# EAGLE design UCLED (EAGLE 9.3.2)
Assembly variants: BASIC
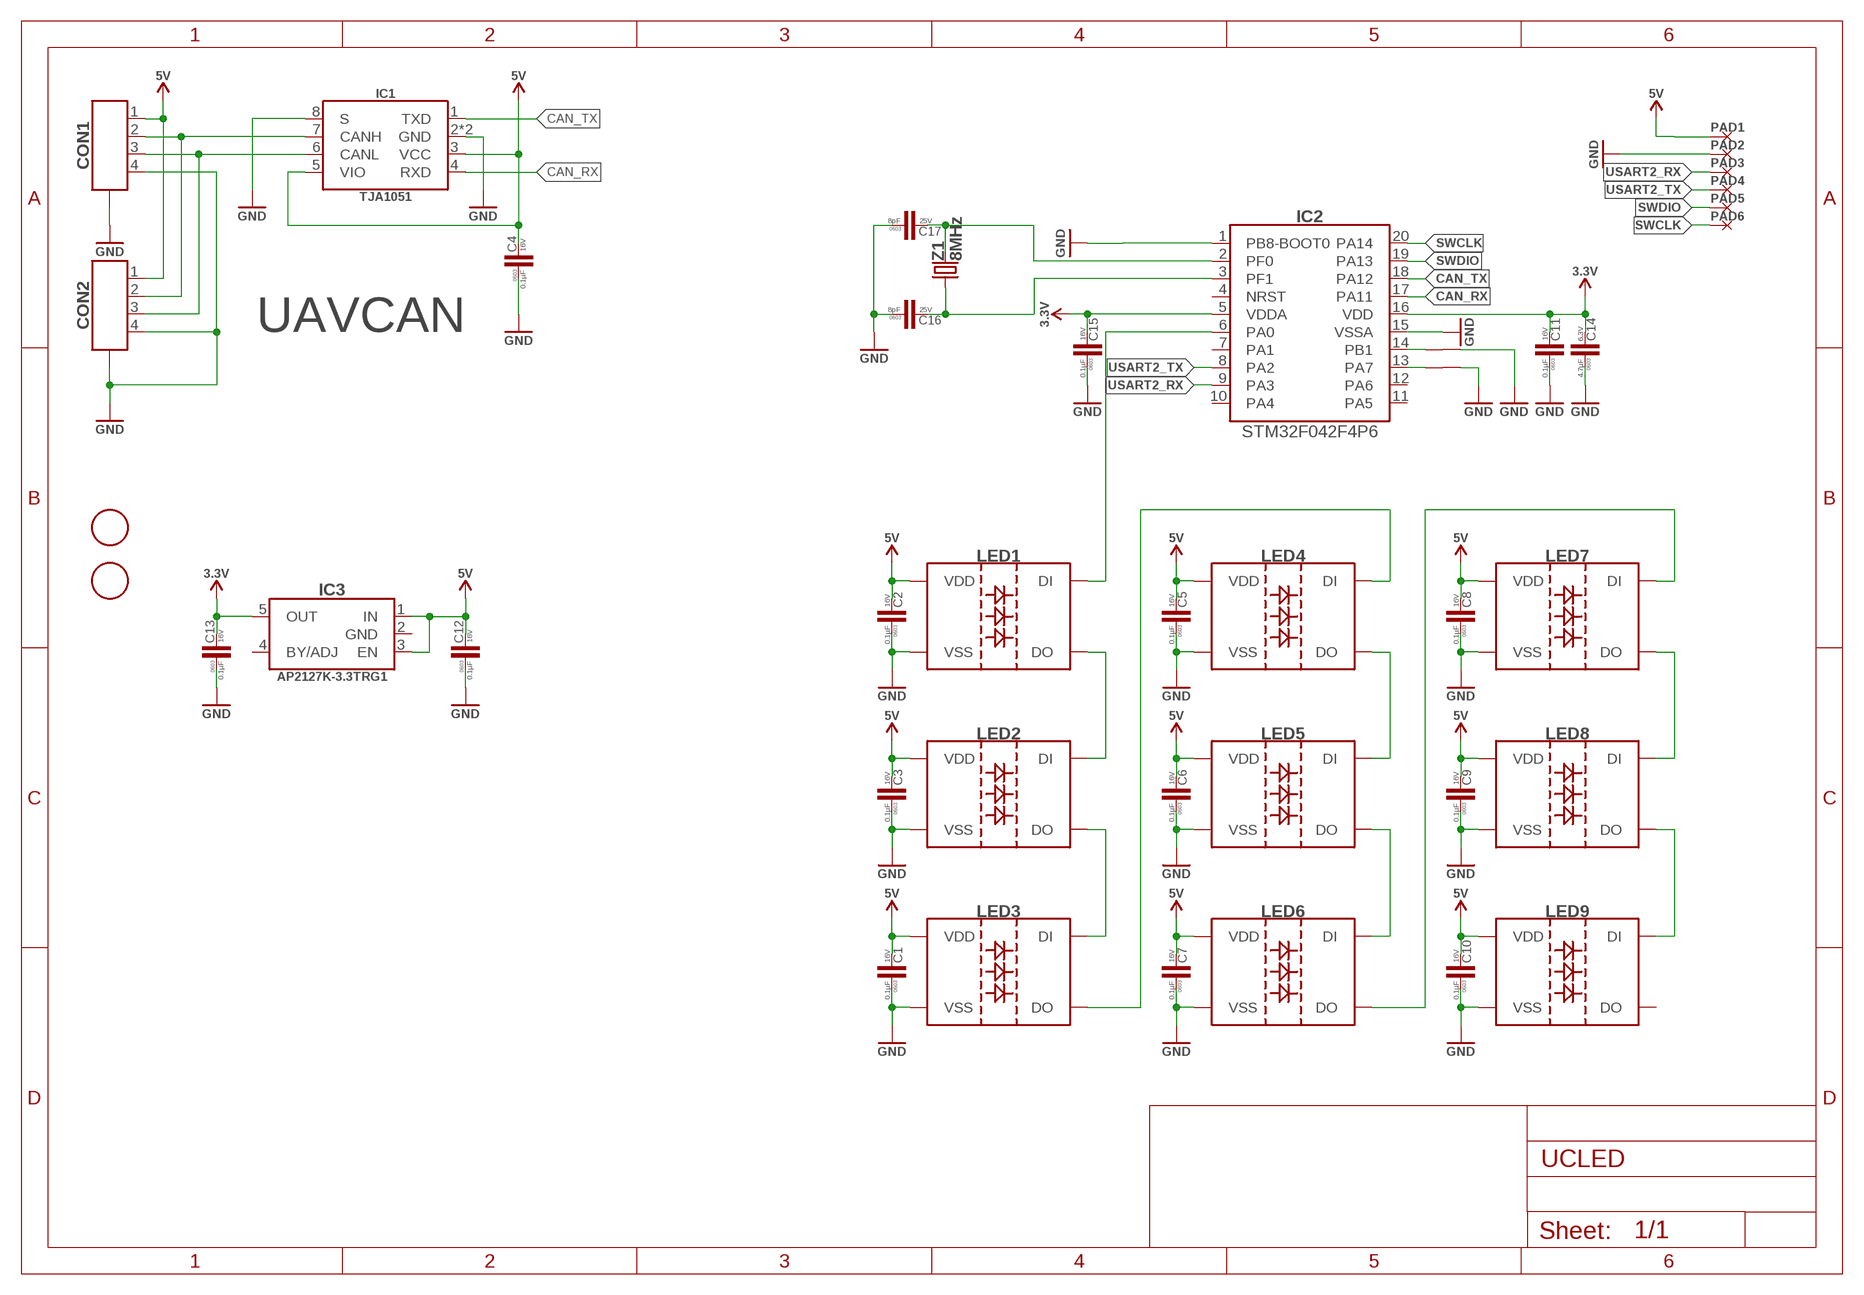
[diagram p0: schematic, sheet 1]

## Parts
C1  0.1µF  0.1µF-16V_10%_X7R-0603  [C0603]
C2  0.1µF  0.1µF-16V_10%_X7R-0603  [C0603]
C3  0.1µF  0.1µF-16V_10%_X7R-0603  [C0603]
C4  0.1µF  0.1µF-16V_10%_X7R-0603  [C0603]
C5  0.1µF  0.1µF-16V_10%_X7R-0603  [C0603]
C6  0.1µF  0.1µF-16V_10%_X7R-0603  [C0603]
C7  0.1µF  0.1µF-16V_10%_X7R-0603  [C0603]
C8  0.1µF  0.1µF-16V_10%_X7R-0603  [C0603]
C9  0.1µF  0.1µF-16V_10%_X7R-0603  [C0603]
C10  0.1µF  0.1µF-16V_10%_X7R-0603  [C0603]
C11  0.1µF  0.1µF-16V_10%_X7R-0603  [C0603]
C12  0.1µF  0.1µF-16V_10%_X7R-0603  [C0603]
C13  0.1µF  0.1µF-16V_10%_X7R-0603  [C0603]
C14  4.7µF  4.7µF-6.3V_10%_X5R-0603  [C0603]
C15  0.1µF  0.1µF-16V_10%_X7R-0603  [C0603]
C16  8pF  8PF-25V_10%_X7R-0603  [C0603]
C17  8pF  8PF-25V_10%_X7R-0603  [C0603]
CON1  CON-4P-TABS-JST_GH-RA  [JST_GH-4P-RA]
CON2  CON-4P-TABS-JST_GH-RA  [JST_GH-4P-RA]
FD1  FIDUCIALMOUNT  [FIDUCIA-MOUNT]  (not fitted in variant BASIC)
FD2  FIDUCIALMOUNT  [FIDUCIA-MOUNT]  (not fitted in variant BASIC)
IC1  TJA1051  [SOT782-1]
IC2  STM32F042F4PX  [TSSOP20]
IC3  AP2127-3.3  [SOT23-5]
J1  CONNECTION  [CONNECTION]  (not fitted in variant BASIC)
J2  CONNECTION  [CONNECTION]  (not fitted in variant BASIC)
LED1  WS2812B  [WS2812B]
LED2  WS2812B  [WS2812B]
LED3  WS2812B  [WS2812B]
LED4  WS2812B  [WS2812B]
LED5  WS2812B  [WS2812B]
LED6  WS2812B  [WS2812B]
LED7  WS2812B  [WS2812B]
LED8  WS2812B  [WS2812B]
LED9  WS2812B  [WS2812B]
PAD1  PAD-S_2X2  [2х2]  (not fitted in variant BASIC)
PAD2  PAD-S_2X2  [2х2]  (not fitted in variant BASIC)
PAD3  PAD-S_2X2  [2х2]  (not fitted in variant BASIC)
PAD4  PAD-S_2X2  [2х2]  (not fitted in variant BASIC)
PAD5  PAD-S_2X2  [2х2]  (not fitted in variant BASIC)
PAD6  PAD-S_2X2  [2х2]  (not fitted in variant BASIC)
Z1  8MHz  CRYSTAL-NX3225GD  [NX3225GD]

## Nets
CAN_RX: IC1.4(RXD) IC2.17(PA11)
CAN_TX: IC1.1(TXD) IC2.18(PA12)
GND: C1.P$1 C2.P$1 C3.P$1 C4.P$1 C5.P$1 C6.P$1 C7.P$1 C8.P$1 C9.P$1 C10.P$1 C11.P$1 C12.P$1 C13.P$1 C14.P$1 C15.P$1 C16.P$1 C17.P$1 CON1.4 CON1.M$0(GND) CON1.M$1(GND) CON2.4 CON2.M$0(GND) CON2.M$1(GND) IC1.2(GND) IC1.8(S) IC1.PAD(GND) IC2.1(PB8-BOOT0) IC2.15(VSSA) J1.P$2 J2.P$2 LED1.3(VSS) LED2.3(VSS) LED3.3(VSS) LED4.3(VSS) LED5.3(VSS) LED6.3(VSS) LED7.3(VSS) LED8.3(VSS) LED9.3(VSS) PAD2.P$1
N$1: IC2.6(PA0) LED1.4(DI)
N$2: LED1.2(DO) LED2.4(DI)
N$3: LED2.2(DO) LED3.4(DI)
N$4: LED3.2(DO) LED4.4(DI)
N$5: LED4.2(DO) LED5.4(DI)
N$6: LED5.2(DO) LED6.4(DI)
N$8: LED6.2(DO) LED7.4(DI)
N$9: LED7.2(DO) LED8.4(DI)
N$10: LED8.2(DO) LED9.4(DI)
N$11: IC2.14(PB1) J1.P$1
N$12: IC2.13(PA7) J2.P$1
N$19: C17.P$2 IC2.2(PF0) Z1.2
N$21: C16.P$2 IC2.3(PF1) Z1.1
N$23: CON1.2 CON2.2 IC1.7(CANH)
N$35: CON1.3 CON2.3 IC1.6(CANL)
SWCLK: IC2.20(PA14) PAD6.P$1
SWDIO: IC2.19(PA13) PAD5.P$1
USART2_RX: IC2.9(PA3) PAD3.P$1
USART2_TX: IC2.8(PA2) PAD4.P$1
VDD_3V3: C11.P$2 C13.P$2 C14.P$2 C15.P$2 IC2.5(VDDA) IC2.16(VDD) IC3.5(OUT) ; supply symbol labelled 3.3V
VDD_5V: C1.P$2 C2.P$2 C3.P$2 C4.P$2 C5.P$2 C6.P$2 C7.P$2 C8.P$2 C9.P$2 C10.P$2 C12.P$2 CON1.1 CON2.1 IC1.3(VCC) IC1.5(VIO) IC3.1(IN) IC3.3(EN) LED1.1(VDD) LED2.1(VDD) LED3.1(VDD) LED4.1(VDD) LED5.1(VDD) LED6.1(VDD) LED7.1(VDD) LED8.1(VDD) LED9.1(VDD) PAD1.P$1 ; supply symbol labelled 5V
Unconnected: IC2.4(NRST) IC2.7(PA1) IC2.10(PA4) IC2.11(PA5) IC2.12(PA6) IC3.4(BY/ADJ) LED9.2(DO)

## Notes on the sheet
- UAVCAN

## Power pins joined to a net without a drawn wire
GND: IC3.2(GND)

## Library data of the parts
C1-C13 C15 = C_digikey:0.1µF; DIGIKEY#: 490-1532-1-ND; MANF: Murata Electronics North America; MANF#: GRM188R71C104KA01D; OPERATING_TEMP: -55°C ~ 125°C; PACKAGE: 0603; TC: X7R; TOLERANCE: +-10%; VOLTAGE: 16V
C14 = C_digikey:4.7µF; DIGIKEY#: 490-3297-1-ND; MANF: Murata Electronics North America; MANF#: GRM188R60J475KE19D; OPERATING_TEMP: -55°C ~ 85°C; PACKAGE: 0603; TC: X5R; TOLERANCE: +-10%; VOLTAGE: 6.3V
C16 C17 = C_digikey:8PF; DIGIKEY#: 490-12681-1-ND; MANF: Murata Electronics North America; MANF#: GRM0335C1E8R0CA01D; OPERATING_TEMP: -55°C ~ 125°C; PACKAGE: 0603; TC: NP0; TOLERANCE: ±0.25pF; VOLTAGE: 25V
CON1 CON2 = Connectors:CON-4P-TABS: Connector Receptacle 4 Position 0.049" (1.25mm) Tin Surface Mount; DIGIKEY#: 455-1566-1-ND; MANF: JST Sales America Inc; MANF#: SM04B-GHS-TB(LF)(SN)
FD1 FD2 = misc:FIDUCIALMOUNT; BOM: EXCLUDE
IC1 = myxa_masterlib:TJA1051: 1/1 Transceiver Half CAN 8-HVSON (3x3); DIGIKEY#: 568-8686-2-ND; MANF: NXP Semiconductors; MANF#: TJA1051TK/3,118
IC2 = stm32:STM32F042F4PX: ARM® Cortex®-M0 STM32F0 Microcontroller IC 32-Bit 48MHz 16KB (16K x 8) FLASH 20-TSSOP; DIGIKEY#: 497-17343-ND; MANF: STMicroelectronics; MANF#: STM32F042F4P6
IC3 = linear regulators:AP2127: IC REG LINEAR 3.3V 300MA SOT23-5; DIGIKEY#: AP2127K-3.3TRG1DITR-ND; I_MAX: 300mA; MANF: Diodes Incorporated; MANF#: AP2127K-3.3TRG1; V_MAX: 6V
J1 J2 = misc:CONNECTION; BOM: EXCLUDE
LED1-LED9 = misc:WS2812B
PAD1-PAD6 = PADS:PAD; BOM: EXCLUDE
Z1 = myxa_masterlib:CRYSTAL; DIGIKEY#: 644-1178-1-ND; MANF: NDK; MANF#: NX3225GD-8MHZ-STD-CRA-3

## Net classes
0 default: clearance 0.205 mm

## Board
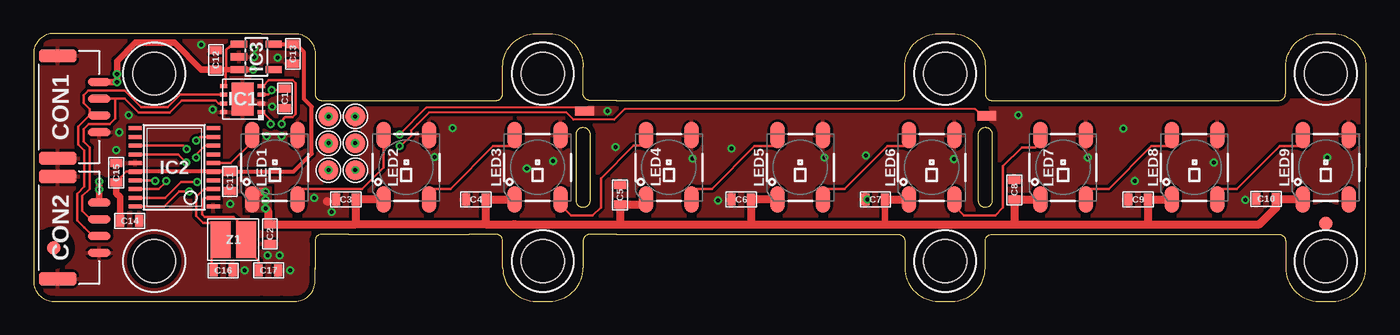
[diagram p1: board, top side]
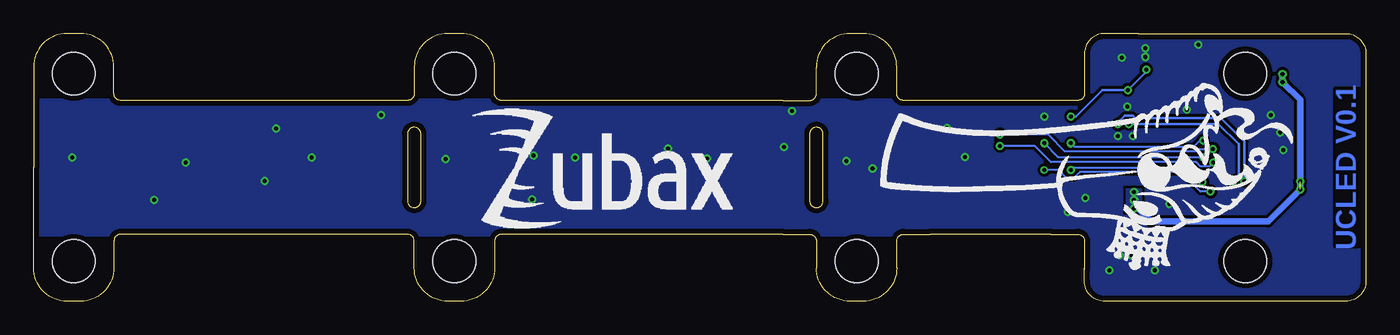
[diagram p2: board, bottom side, seen from below]

Size 99.4 x 20 mm. Coordinates in mm from the lower left corner, seen from the top.
Outline: 21,2.4 21,1.5 arc-90 19.5,0 18.5,0 17,0 1.5,0 arc-90 0,1.5 0,18.5 arc-90 1.5,20 17,20 18.5,20 19.5,20 arc-90 21,18.5 21,17.6 21,17.5 21,15.5 arc90 21.5,15 23.5,15 32.5,15 34.5,15 arc90 35,15.5 35,17.5 arc-90 37.5,20 38.5,20 arc-90 41,17.5 41,15.5 arc90 41.5,15 43.5,15 45,15 62.5,15 64.5,15 arc90 65,15.5 65,17.4 65,17.5 arc-90 67.5,20 68.5,20 arc-90 71,17.5 71,15.5 arc90 71.5,15 73.5,15 90.9,15 92.9,15 arc90 93.4,15.5 93.4,17.5 arc-90 95.9,20 96.9,20 arc-90 99.4,17.5 99.4,10 99.4,2.5 arc-90 96.9,0 95.9,0 arc-90 93.4,2.5 93.4,4.5 arc90 92.9,5 90.9,5 73.5,5 71.5,5 arc90 71,4.5 71,2.5 arc-90 68.5,0 67.5,0 arc-90 65,2.5 65,4.5 arc90 64.5,5 62.5,5 45,5 43.5,5 41.5,5 arc90 41,4.5 41,2.5 arc-90 38.5,0 37.5,0 arc-90 35,2.5 35,4.5 arc90 34.5,5 32.5,5 23.5,5 21.5,5 arc90 21,4.5 21,2.4
Outline: 21,2.4 21,2.5
Outline: 41.5,12.5 41.5,7.5 arc-90 41,7 arc-90 40.5,7.5 40.5,12.5 arc-90 41,13 arc-90 41.5,12.5
Outline: 71.5,12.5 71.5,7.5 arc-90 71,7 arc-90 70.5,7.5 70.5,12.5 arc-90 71,13 arc-90 71.5,12.5
Copper layers (1*16): Top 0.035mm / dielectric 1mm / Bottom 0.035mm
Design rules "design_rules *": minimum track width 0.15mm, minimum drill 0.2mm, track to track 0.15mm, track to pad 0.15mm, pad to pad 0.2mm, via to via 0.2mm, smd to smd 0.15mm, copper to edge 0.4mm, drill to drill 0.2mm, minimum pad ring 0.125mm, minimum via ring 0.125mm, stop-mask expansion 1mil, vias tented up to drill 0.35mm, thermal gap 8mil
Holes 3.2 mm at 96.4,17 96.4,3 68,17 68,3 38,17 38,3 9,17 9,3

### Footprints (pad centres in the part's own frame; a part is rotated, then mirrored left to right if it is on the bottom)
C0603 = smd 0.6 x 0.9: P$1 -0.725,0; P$2 0.725,0
JST_GH-4P-RA = smd 0.6 x 1.7: 1 1.875,-2.91; 2 0.625,-2.91; 3 -0.625,-2.91; 4 -1.875,-2.91 | smd 1 x 2.8: M$0 -3.825,0.19; M$1 3.825,0.19
FIDUCIA-MOUNT = smd 1.016 x 1.016: P$1 0,0
SOT782-1 = smd 0.525 x 0.3: 1 -1.4,0.975; 2 -1.4,0.325; 3 -1.4,-0.325; 4 -1.4,-0.975; 5 1.4,-0.975; 6 1.4,-0.325; 7 1.4,0.325; 8 1.4,0.975 | smd 1.65 x 2.45: PAD 0,0
TSSOP20 = smd 0.305 x 0.991: 1 -2.925,-2.918; 2 -2.275,-2.918; 3 -1.625,-2.918; 4 -0.975,-2.918; 5 -0.325,-2.918; 6 0.325,-2.918; 7 0.975,-2.918; 8 1.625,-2.918; 9 2.275,-2.918; 10 2.925,-2.918; 11 2.925,2.918; 12 2.275,2.918; 13 1.625,2.918; 14 0.975,2.918; 15 0.325,2.918; 16 -0.325,2.918; 17 -0.975,2.918; 18 -1.625,2.918; 19 -2.275,2.918; 20 -2.925,2.918
SOT23-5 = smd 0.55 x 1.2: 1 -0.95,-1.3; 2 0,-1.3; 3 0.95,-1.3; 4 0.95,1.3; 5 -0.95,1.3
CONNECTION = smd 0.7 x 0.7: P$1 -0.35,0; P$2 0.35,0
WS2812B = smd 2 x 1.1: 1 -2.4,1.7; 2 -2.4,-1.7; 3 2.4,-1.7; 4 2.4,1.7
2х2 = smd 1.5 x 1.5: P$1 0,0
NX3225GD = smd 1.5 x 2.7: 1 -0.95,0; 2 0.95,0

### Placement (x,y rotation side)
C1  18.75,15.15 90 top
C2  17.64,5.02 90 top
C3  23.3,7.6 0 top
C4  33,7.6 0 top
C5  43.75,7.95 270 top
C6  52.8,7.6 0 top
C7  62.8,7.6 0 top
C8  73.17,8.32 270 top
C9  82.4,7.6 0 top
C10  91.95,7.65 0 top
C11  14.65,8.95 90 top
C12  13.6,18.02 270 top
C13  19.35,18.48 90 top
C14  7.18,6 180 top
C15  6.18,9.6 270 top
C16  14.15,2.3 180 top
C17  17.54,2.31 180 top
CON1  2,14.5 90 top
CON2  2,5.5 90 top
FD1  96.4,5.8 0 top  (not fitted)
FD2  1.5,4 0 top  (not fitted)
IC1  15.6,15.1 180 top
IC2  10.5,10 90 top
IC3  16.62,18.25 270 top
J1  71.1,13.85 0 top  (not fitted)
J2  41.1,14.2 0 top  (not fitted)
LED1  18,10 90 top
LED2  27.8,10 90 top
LED3  37.6,10 90 top
LED4  47.4,10 90 top
LED5  57.2,10 90 top
LED6  67,10 90 top
LED7  76.8,10 90 top
LED8  86.6,10 90 top
LED9  96.4,10 90 top
PAD1  22,13.8 90 top  (not fitted)
PAD2  24,13.8 90 top  (not fitted)
PAD3  22,11.8 90 top  (not fitted)
PAD4  24,11.8 90 top  (not fitted)
PAD5  22,9.8 90 top  (not fitted)
PAD6  24,9.8 90 top  (not fitted)
U$2  [DRAGON-30X13]  5.45,16.35 180 bottom
U$3  [ZUBAX_20X9]  67.1,5.2 0 bottom
Z1  14.9,4.6 0 top

### Tracks (layer width: path | path; a pad name or v marks a point on that pad's centre or on a via)
CAN_RX  (via drill 0.3 pad 0.6)
  Top 0.2: v9.07,9 9.05,9.03 IC2.17 | IC1.4 17.12,16.07 17.55,16.5 19.32,16.5 19.55,16.27 19.55,13.97 19.32,13.75 18.77,13.75 18.5,13.47 v18.5,13.22
  Bottom 0.2: v9.07,9 9.07,11.93 10.82,13.68 17.2,13.68 17.4,13.88 17.98,13.88 18.5,13.35 v18.5,13.22
CAN_TX  (via drill 0.3 pad 0.6)
  Top 0.2: IC2.18 9.35,8.38 9.9,8.93 v9.9,8.97 | v17.68,13.25 17.68,13.55 17.1,14.12 IC1.1
  Bottom 0.2: v9.9,8.97 v9.89,8.98 9.89,9.05 9.49,9.45 9.49,11.75 11,13.25 16.95,13.25 v17.68,13.25
GND  (via drill 0.3 pad 0.6)
  Top 0.6: 21.9,7.47 21.95,7.42
  other vias: 13.38,14.3 15.75,2.29 36.8,9.9 81.3,12.9 17.45,3.42 18.36,3.42 19.13,2.29 51.05,7.52 62.2,7.62 82.16,9 90.41,7.57 52.05,11.42 62.1,10.87 88.06,10.37 38.75,10.47 31.26,12.92 49.16,10.67 59.01,10.72 68.66,10.62 78.66,10.72 96.5,10.72 29.91,10.77 6.38,12.62 7.11,13.89 6.15,11.29 16.45,18.25 14.65,7.27 12.5,19.18 18.2,18.2 16.45,18.9 17.8,14.55 22.23,6.67 20.95,7.7 17.4,12.35 18.5,12.35 42.8,14.22 73.45,13.92 24,13.8 43.41,11.52
  pour Top (rank 5): 0,0 21,0 21,5 99.4,5 99.4,15 21,15 21,20 0,20
  pour Bottom (rank 5): 99.4,5 21,5 21,0 1,0 arc-90 0,1 0,19 arc-90 1,20 21,20 21,15 99.4,15
N$1
  Top 0.2: LED1.4 16.3,11.9 14.72,10.32 IC2.6
N$2
  Top 0.2: LED2.4 26.1,10 24.5,8.4 19.7,8.4 LED1.2
N$3
  Top 0.2: LED2.2 29.5,8.4 31.1,8.4 34.3,11.6 35.9,11.6 LED3.4
N$4
  Top 0.2: LED3.2 39.3,7.2 40.1,6.4 41.72,6.4 42.33,7.01 42.33,9.18 44.77,11.62 45.45,11.62 45.7,11.88 LED4.4
N$5
  Top 0.2: LED4.2 49.1,8.4 50.6,8.4 53.8,11.6 55.5,11.6 LED5.4
N$6
  Top 0.2: LED5.2 58.9,8.4 60.5,8.4 63.7,11.6 65.3,11.6 LED6.4
N$8
  Top 0.2: LED6.2 68.7,7.12 69.4,6.42 71.74,6.42 72.33,7.01 72.33,10.1 73.72,11.5 74.75,11.5 75.1,11.85 LED7.4
N$9
  Top 0.2: LED7.2 78.5,8.4 80.2,8.4 83.4,11.6 84.8,11.6 84.9,11.7 LED8.4
N$10
  Top 0.2: LED8.2 88.3,8.4 89.78,8.4 92.97,11.6 94.7,11.6 LED9.4
N$11  (via drill 0.3 pad 0.6)
  Top 0.15: J1.P$1 70.25,14.35 44.1,14.35 43.32,13.57 40.28,13.57 39.76,14.09 29.49,14.09 28.6,13.2 28.15,12.75 28.15,12.35 27.4,11.6 v27.3,11.6
  Top 0.2: IC2.14 10.78,10.97 11.38,10.38 v11.4,10.38
  Bottom 0.15: v11.4,10.38 11.7,10.07 12.35,10.07 12.68,10.4 23.5,10.4 24.7,11.6 v27.3,11.6
N$12  (via drill 0.3 pad 0.6)
  Top 0.15: J2.P$1 40.5,14.45 29.3,14.45 v27.3,12.45
  Top 0.2: IC2.13 11.18,11.62 v11.43,11.38
  Bottom 0.15: v11.43,11.38 12.43,11.38 12.6,11.2 22.45,11.2 23.7,12.45 v27.3,12.45
N$19
  Top 0.2: IC2.2 12.72,7.72 12.57,7.58 12.57,6.5 12.78,6.3 14.93,6.3 15.2,6.03 15.2,5.85 15.85,5.2 Z1.2 15.85,3.99 16.81,3.03 C17.P$2
N$21
  Top 0.2: IC2.3 12.72,8.38 12.12,7.78 12.12,6.38 12.65,5.85 13.5,5.85 13.95,5.4 13.95,4.7 | 13.95,4.7 Z1.1 | C16.P$2 13.3,2.42 13.3,4.05 13.95,4.7
N$23
  Top 0.2: IC1.7 13.8,14.78 13.6,14.97 11.05,14.97 10.17,14.09 7.86,14.09 6.8,15.15 6.15,15.15 | CON2.2 4.28,6.12 3.65,6.75 3.65,7.85 4.21,8.4 4.21,11.5 3.76,11.95 3.76,12.88 4.13,13.25 5.69,13.25 6.1,13.66 6.1,15.1 6.15,15.15 | 6.15,15.15 4.94,15.15 CON1.2
N$35
  Top 0.2: IC1.6 10.93,15.43 10,14.5 8.05,14.5 6.82,15.73 4.08,15.73 3.75,15.4 3.75,14.8 4.2,14.35 4.2,14.15 | CON1.3 4.38,13.88 4.2,13.88 4.2,14.15 | CON2.3 4.43,4.88 3.8,5.5 3.24,6.05 3.24,8.02 3.8,8.57 3.8,11.27 3.35,11.72 3.35,13.04 4.2,13.89 4.2,14.15
SWCLK  (via drill 0.3, 0.3 pad 0.6)
  Top 0.2: IC2.20 9.75,7.08 10.88,8.2 v11.6,8.2
  Bottom 0.15: v11.6,8.2 12.35,8.2 13.79,9.64 21.34,9.64 21.74,9.24 | PAD6.P$1 22.93,9.8 22.34,9.22 21.76,9.22 | 21.74,9.24 21.76,9.22 | 21.74,9.24 21.76,9.22
  other vias: 24,9.8
SWDIO  (via drill 0.3 pad 0.6)
  Top 0.2: IC2.19 9.82,7.72 11,8.9 v12.2,8.9
  Bottom 0.15: v12.2,8.9 12.35,8.9 13.45,10 21.8,10 PAD5.P$1
  other vias: 22,9.8
USART2_RX  (via drill 0.3 pad 0.6)
  Top 0.2: IC2.9 12.43,12.28 v12.15,12
  Bottom 0.15: v12.15,12 12.4,12 12.82,11.57 21.77,11.57 PAD3.P$1
  other vias: 22,11.8
USART2_TX  (via drill 0.3 pad 0.6)
  Top 0.2: IC2.8 12.81,11.62 12.15,10.96 v12.15,10.75
  Bottom 0.15: PAD4.P$1 22.98,10.78 12.15,10.78 v12.15,10.75
  other vias: 24,11.8
VDD_3V3
  Top 0.2: C15.P$2 6.5,8.88 6.53,8.9 6.53,9.27 6.93,9.68 IC2.16
  Top 0.3: IC3.5 C13.P$2 19.57,19.2 20.18,18.6 20.18,15.1 20.75,14.53 20.75,11.03 19.4,9.68 C11.P$2 IC2.5 IC2.16
  Top 0.5: C14.P$2 6.45,7.78 6.18,8.05 C15.P$2
VDD_5V  (via drill 0.3 pad 0.6)  (1 unrouted)
  Top 0.2: 17.05,15.47 IC1.3 17.5,15.43 17.77,15.7 v17.77,15.78 18.65,15.78 C1.P$2 | IC1.5 14.35,16.07 14.35,17.3 14.4,17.3 14.38,17.32 14.38,18.77 14.62,19.02 15.15,19.02 IC3.1
  Top 0.4: C12.P$2 14.4,17.3 IC3.3 v16.4,17.3
  Top 0.5: CON2.1 v4.91,8.94 | CON1.1 v6.22,16.38 6.22,17.95 7.57,19.3 10.53,19.3 12.53,17.3 13.12,17.3 C12.P$2 | C7.P$2 63.52,5.82 63.45,5.75
  Top 0.6: LED9.1 94.7,7.5 94.55,7.65 C10.P$2 92.67,6.97 91.45,5.75 83.1,5.75 | C7.P$2 LED6.1 65.3,6.9 | 35.9,7.35 LED3.1 C4.P$2 33.73,5.75 | 84.9,7.2 LED8.1 C9.P$2 83.12,5.77 83.1,5.75 | 55.5,7.1 LED5.1 C6.P$2 53.52,5.79 53.58,5.75 | 26.1,7.2 LED2.1 C3.P$2 24.02,5.75 | v17.3,8.15 16.85,8.15 LED1.1 | v17.3,6.95 17.49,6.76 17.49,5.89 C2.P$2 24.02,5.75 | 33.73,5.75 35.83,5.75 35.9,5.75 43.75,5.75 | 73.08,5.75 63.45,5.75 53.58,5.75 | 73.08,5.75 83.1,5.75 | 43.75,5.75 C5.P$2 45.67,7.22 45.73,7.17 45.7,7.2 LED4.1 | 73.08,5.75 73.17,5.84 C8.P$2 LED7.1 | 43.75,5.75 53.58,5.75 | 33.73,5.75 24.02,5.75
  Bottom 0.2: v16.4,17.3 16.4,17.15 v17.77,15.78 19.68,15.78 21.65,13.8 PAD1.P$1
  Bottom 0.5: v6.22,16.98 v6.22,16.38 4.91,15.06 v4.91,8.34 7.3,5.95 16.02,5.95 17.02,6.95 v17.3,6.95
  other vias: 17.3,7.55 22,13.8
  pour Top (no thermals): 15.85,8.5 17.7,8.5 17.7,6.7 15.85,6.7
  pour Bottom (no thermals): 17.85,8.38 16.8,8.38 16.8,6.72 17.85,6.72

### Text on the board
Bottom: UCLED V0.1